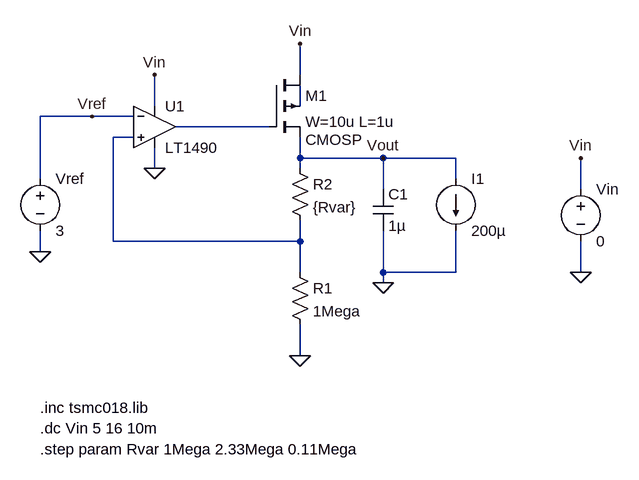
[diagram p0: schematic q2_pmos.asc]
q2_pmos.asc, the LTspice schematic file:
Version 4.1
SHEET 1 912 1044
WIRE 416 80 416 32
WIRE 192 128 192 80
WIRE 416 128 416 96
WIRE 96 144 16 144
WIRE 160 144 96 144
WIRE 368 160 224 160
WIRE 160 176 128 176
WIRE 416 208 416 176
WIRE 544 208 416 208
WIRE 656 208 544 208
WIRE 192 224 192 192
WIRE 416 224 416 208
WIRE 16 240 16 144
WIRE 656 240 656 208
WIRE 544 256 544 208
WIRE 848 256 848 208
WIRE 128 336 128 176
WIRE 416 336 416 304
WIRE 416 336 128 336
WIRE 16 352 16 320
WIRE 416 384 416 336
WIRE 544 384 544 320
WIRE 656 384 656 320
WIRE 656 384 544 384
WIRE 848 384 848 336
WIRE 544 400 544 384
WIRE 416 512 416 464
FLAG 416 32 Vin
FLAG 96 144 Vref
FLAG 416 512 0
FLAG 544 208 Vout
FLAG 848 208 Vin
FLAG 848 384 0
FLAG 16 352 0
FLAG 544 400 0
FLAG 192 80 Vin
FLAG 192 224 0
SYMBOL res 400 368 R0
SYMATTR InstName R1
SYMATTR Value 1Mega
SYMBOL res 400 208 R0
SYMATTR InstName R2
SYMATTR Value {Rvar}
SYMBOL voltage 848 240 R0
WINDOW 123 0 0 Left 0
WINDOW 39 0 0 Left 0
SYMATTR InstName Vin
SYMATTR Value 0
SYMBOL voltage 16 224 R0
WINDOW 123 0 0 Left 0
WINDOW 39 0 0 Left 0
SYMATTR InstName Vref
SYMATTR Value 3
SYMBOL cap 528 256 R0
SYMATTR InstName C1
SYMATTR Value 1µ
SYMBOL OpAmps\\LT1490 192 96 R0
SYMATTR InstName U1
SYMBOL current 656 240 R0
WINDOW 123 0 0 Left 0
WINDOW 39 0 0 Left 0
SYMATTR InstName I1
SYMATTR Value 200µ
SYMBOL pmos4 368 80 R0
WINDOW 38 56 100 Left 2
SYMATTR InstName M1
SYMATTR Value W=10u L=1u
SYMATTR SpiceModel CMOSP
TEXT 16 592 Left 2 !.inc tsmc018.lib
TEXT 16 624 Left 2 !.dc Vin 5 16 10m
TEXT 16 656 Left 2 !.step param Rvar 1Mega 2.33Mega 0.11Mega

The netlist it stands for:
* q2_pmos.asc
R1 N003 0 1Mega
R2 Vout N003 {Rvar}
Vin Vin 0 0
Vref Vref 0 3
C1 Vout 0 1µ
X§U1 N003 Vref Vin 0 N002 LT1490  ; pins In+ In- V+ V- OUT
I1 Vout 0 200µ
M1 Vin N002 Vout N001 CMOSP W=10u L=1u
.model NMOS NMOS
.model PMOS PMOS
.lib standard.mos
.inc tsmc018.lib
.dc Vin 5 16 10m
.step param Rvar 1Mega 2.33Mega 0.11Mega
.backanno
.end

* Results of the author's LTspice run, read from the files saved beside the schematic
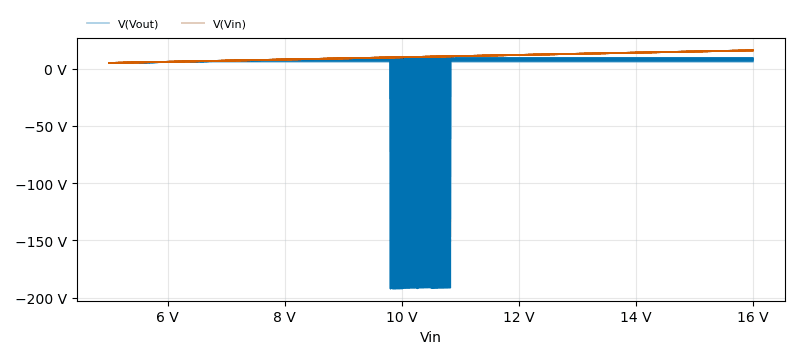
[diagram p1: DC transfer characteristic of q2_pmos.asc, plotted from the saved traces]
* DC transfer characteristic, 13 runs:
*   V(Vout) [run 1]: 4.859 V at Vin=5 V, 5.997 V at Vin=16 V, min 4.859 V, max 5.999 V
*   V(Vout) [run 2]: 4.859 V at Vin=5 V, 6.303 V at Vin=16 V, min 4.859 V, max 6.306 V
*   V(Vout) [run 3]: 4.859 V at Vin=5 V, 6.61 V at Vin=16 V, min 4.859 V, max 6.612 V
*   V(Vout) [run 4]: 4.859 V at Vin=5 V, 6.917 V at Vin=16 V, min 4.859 V, max 6.919 V
*   V(Vout) [run 5]: 4.86 V at Vin=5 V, 7.223 V at Vin=16 V, min 4.86 V, max 7.226 V
*   V(Vout) [run 6]: 4.86 V at Vin=5 V, 7.53 V at Vin=16 V, min 4.86 V, max 7.533 V
*   V(Vout) [run 7]: 4.86 V at Vin=5 V, 7.836 V at Vin=16 V, min 4.86 V, max 7.839 V
*   V(Vout) [run 8]: 4.86 V at Vin=5 V, 8.143 V at Vin=16 V, min 4.86 V, max 8.146 V
*   V(Vin) [run 1]: 5 V at Vin=5 V, 16 V at Vin=16 V, min 5 V, max 16 V
*   V(Vin) [run 2]: 5 V at Vin=5 V, 16 V at Vin=16 V, min 5 V, max 16 V
*   V(Vin) [run 3]: 5 V at Vin=5 V, 16 V at Vin=16 V, min 5 V, max 16 V
*   V(Vin) [run 4]: 5 V at Vin=5 V, 16 V at Vin=16 V, min 5 V, max 16 V
*   V(Vin) [run 5]: 5 V at Vin=5 V, 16 V at Vin=16 V, min 5 V, max 16 V
*   V(Vin) [run 6]: 5 V at Vin=5 V, 16 V at Vin=16 V, min 5 V, max 16 V
*   V(Vin) [run 7]: 5 V at Vin=5 V, 16 V at Vin=16 V, min 5 V, max 16 V
*   V(Vin) [run 8]: 5 V at Vin=5 V, 16 V at Vin=16 V, min 5 V, max 16 V